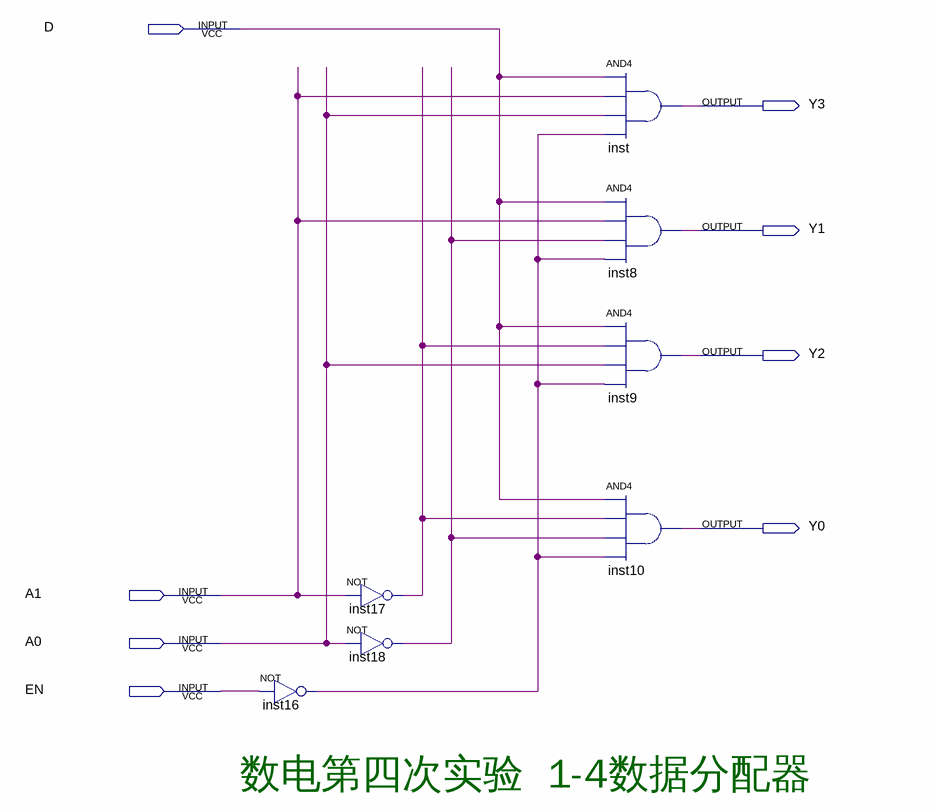
[diagram p0: schematic sheet]
// Quartus schematic distributer.bdf as structural Verilog: 7 symbols, 8 pins
module distributer (
  input  D,
  input  A1,
  input  A0,
  input  EN,
  output Y3,
  output Y1,
  output Y2,
  output Y0
);

  wire inst16_out, inst17_out, inst18_out;

  not inst16 (inst16_out, EN);
  not inst17 (inst17_out, A1);
  not inst18 (inst18_out, A0);
  and inst (Y3, D, A1, A0, inst16_out);
  and inst8 (Y1, D, A1, inst18_out, inst16_out);
  and inst9 (Y2, D, inst17_out, A0, inst16_out);
  and inst10 (Y0, D, inst17_out, inst18_out, inst16_out);

  // Notes on the sheet:
  //   数电第四次实验  1-4数据分配器
endmodule
